# EAGLE schematic PSCommutationRobot (EAGLE 6.3)
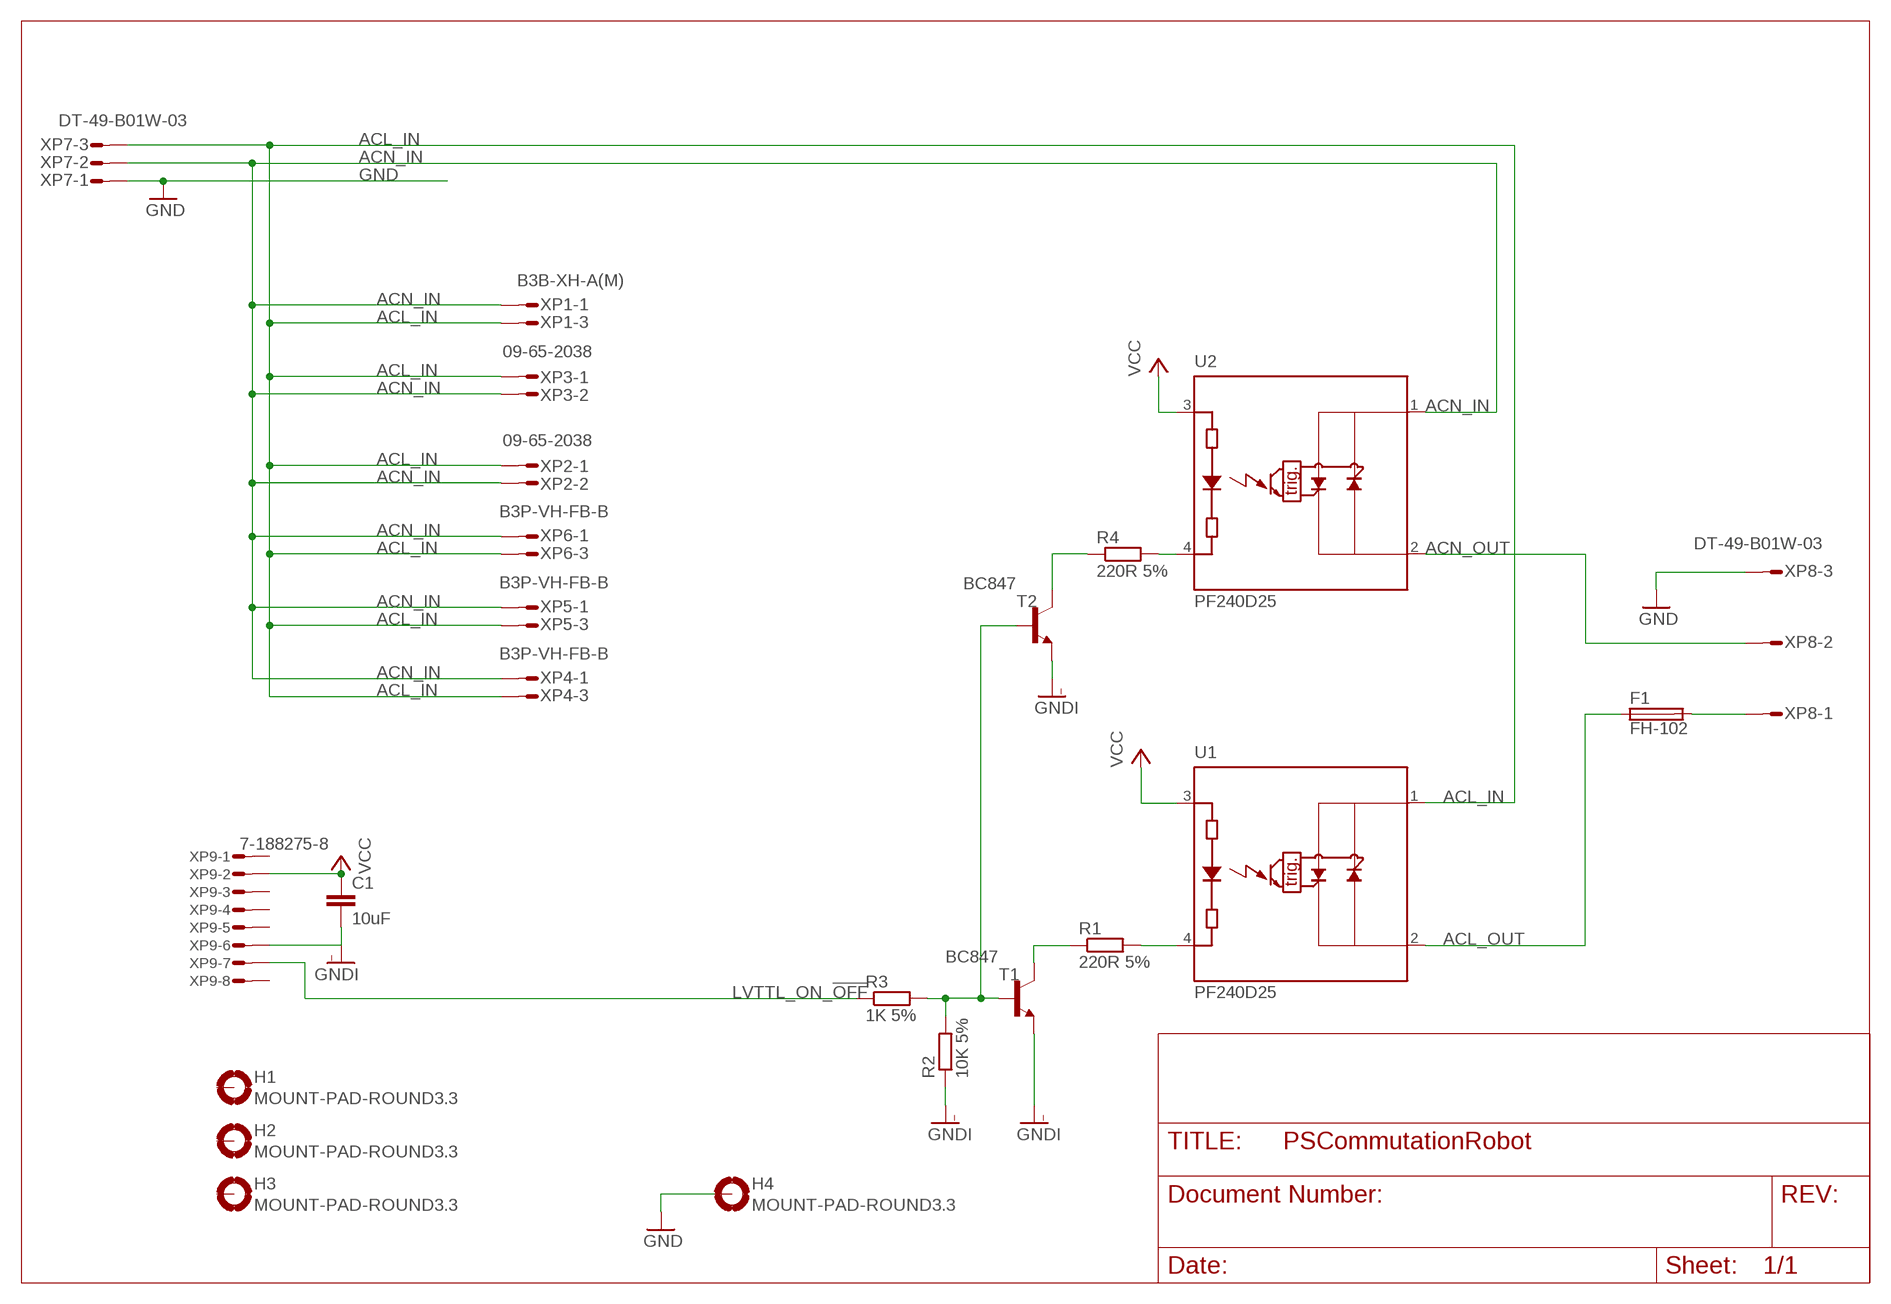
[diagram p0: schematic, sheet 1]

## Parts
C1  10uF  C-EUC1206  [C1206]
F1  FH-102  FUSESH22,5A  [SH22,5A]
H1  MOUNT-PAD-ROUND3.3  [3,3-PAD]
H2  MOUNT-PAD-ROUND3.3  [3,3-PAD]
H3  MOUNT-PAD-ROUND3.3  [3,3-PAD]
H4  MOUNT-PAD-ROUND3.3  [3,3-PAD]
R1  220R 5%  R-EU_R0805  [R0805]
R2  10K 5%  R-EU_R0805  [R0805]
R3  1K 5%  R-EU_R0805  [R0805]
R4  220R 5%  R-EU_R0805  [R0805]
T1  BC847  BC847-NPN-SOT23-BEC  [SOT23-BEC]
T2  BC847  BC847-NPN-SOT23-BEC  [SOT23-BEC]
U1  PF240D25  CRYDOM_PF240D25  [CRYDOM_PF240D25]
U2  PF240D25  CRYDOM_PF240D25  [CRYDOM_PF240D25]
XP1  B3B-XH-A(M)  [JST_B3B-XH-AM]
XP2  09-65-2038  MOLEX_09-65-2038_WITHOUT_CENTER_PIN  [MOLEX_09-65-2038_WITHOUT_CENTRAL_PIN]
XP3  09-65-2038  MOLEX_09-65-2038_WITHOUT_CENTER_PIN  [MOLEX_09-65-2038_WITHOUT_CENTRAL_PIN]
XP4  B3P-VH-FB-B  JST_B3P-VH-FB-B_WITHOUT_CENTER_PIN  [JST_B3P-VH-FB-B_WITHOUT_CENTRAL_PIN]
XP5  B3P-VH-FB-B  JST_B3P-VH-FB-B_WITHOUT_CENTER_PIN  [JST_B3P-VH-FB-B_WITHOUT_CENTRAL_PIN]
XP6  B3P-VH-FB-B  JST_B3P-VH-FB-B_WITHOUT_CENTER_PIN  [JST_B3P-VH-FB-B_WITHOUT_CENTRAL_PIN]
XP7  DT-49-B01W-03  DINKLE_DT-49-B01W-03  [DINKLE_DT-49-B01W-03]
XP8  DT-49-B01W-03  DINKLE_DT-49-B01W-03  [DINKLE_DT-49-B01W-03]
XP9  7-188275-8  MICROMATCH-8SMF  [MMT-F-SMD-8]

## Nets
ACL_IN: U1.1(DS1) XP1.3 XP2.1 XP3.1 XP4.3 XP5.3 XP6.3 XP7.3
ACL_OUT: F1.1 U1.2(DS2)
ACN_IN: U2.1(DS1) XP1.1 XP2.2 XP3.2 XP4.1 XP5.1 XP6.1 XP7.2
ACN_OUT: U2.2(DS2) XP8.2
GND: H4.B3,3(MOUNT) XP7.1 XP8.3
GNDI: C1.2 R2.1 T1.E T2.E XP9.6
LVTTL_ON_!OFF: R3.1 XP9.7
N$1: R1.1 T1.C
N$2: R1.2 U1.4(K)
N$3: R2.2 R3.2 T1.B T2.B
N$4: R4.1 T2.C
N$5: R4.2 U2.4(K)
N$6: F1.2 XP8.1
VCC: C1.1 U1.3(A) U2.3(A) XP9.2
Unconnected: H1.B3,3(MOUNT) H2.B3,3(MOUNT) H3.B3,3(MOUNT) XP1.2 XP9.1 XP9.3 XP9.4 XP9.5 XP9.8

## Library data of the parts
C1 = rcl:C-EU: CAPACITOR, European symbol
F1 = fuse:FUSE: Fuse; OC_FARNELL: unknown; OC_NEWARK: unknown
H1-H4 = holes:MOUNT-PAD-ROUND: MOUNTING PAD, round
R1-R4 = rcl:R-EU_: RESISTOR, European symbol
T1 T2 = transistor:*-NPN-: NPN Transistror BF959 corrected 2008.03.06
U1 U2 = my_components:CRYDOM_PF240D25
XP1 = my_components:B3B-XH-A(M): B3B-XH-A(M) Top entry type, 2.5 mm, 3 pins 1 row
XP2 XP3 = my_components:MOLEX_09-65-2038_WITHOUT_CENTER_PIN
XP4-XP6 = my_components:JST_B3P-VH-FB-B_WITHOUT_CENTER_PIN
XP7 XP8 = my_components:DINKLE_DT-49-B01W-03: Barrier Style Terminal Blocks Manufacturer: Dinkle Rated voltage: 300V Rated current: 25A(Version B) 10A(Vers. D)
XP9 = con-amp-micromatch:MICROMATCH-8: MicroMaTch 8 7-215464-8 / 0-215464-8 Drawing Number C-215464 DDEController.pdf